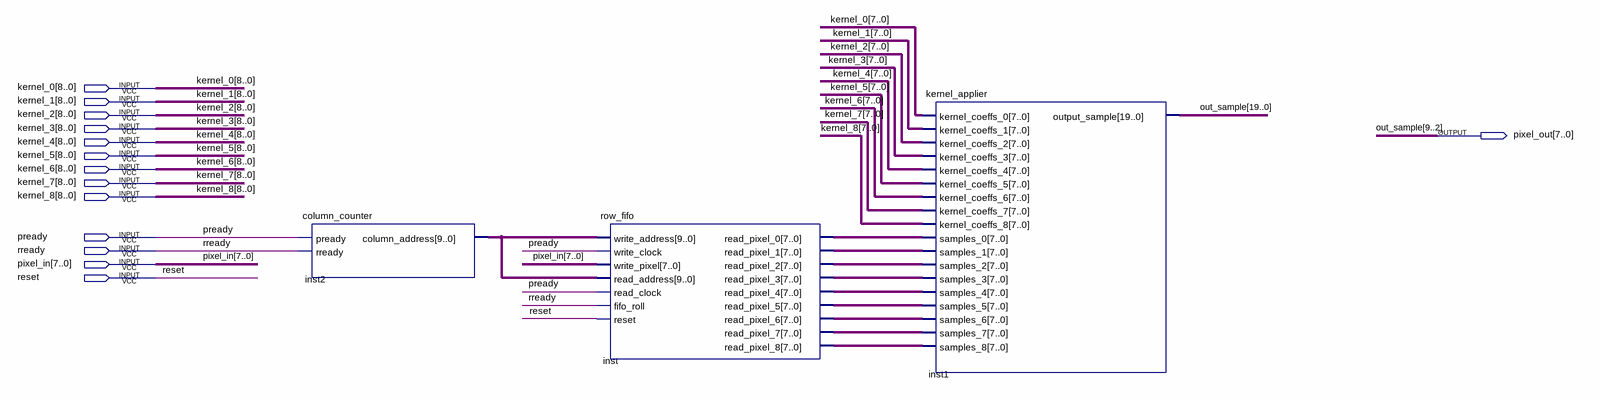
[diagram p0: schematic sheet]
// Quartus schematic processing.bdf as structural Verilog: 3 symbols, 14 pins
module processing (
  input  [8:0] kernel_0,
  input  [8:0] kernel_1,
  input  [8:0] kernel_2,
  input  [8:0] kernel_3,
  input  [8:0] kernel_4,
  input  [8:0] kernel_5,
  input  [8:0] kernel_6,
  input  [8:0] kernel_7,
  input  [8:0] kernel_8,
  input  pready,
  input  rready,
  input  [7:0] pixel_in,
  input  reset,
  output [7:0] pixel_out
);

  wire [7:0] inst_read_pixel_0, inst_read_pixel_1, inst_read_pixel_2, inst_read_pixel_3, inst_read_pixel_4,
       inst_read_pixel_5, inst_read_pixel_6, inst_read_pixel_7, inst_read_pixel_8;
  wire [9:0] inst2_column_address;
  wire [19:0] out_sample;

  column_counter inst2 (.pready(pready), .rready(rready), .column_address(inst2_column_address));
  row_fifo inst (
    .write_address(inst2_column_address), .write_clock(pready), .write_pixel(pixel_in),
    .read_address(inst2_column_address), .read_clock(pready), .fifo_roll(rready), .reset(reset),
    .read_pixel_0(inst_read_pixel_0), .read_pixel_1(inst_read_pixel_1), .read_pixel_2(inst_read_pixel_2),
    .read_pixel_3(inst_read_pixel_3), .read_pixel_4(inst_read_pixel_4), .read_pixel_5(inst_read_pixel_5),
    .read_pixel_6(inst_read_pixel_6), .read_pixel_7(inst_read_pixel_7), .read_pixel_8(inst_read_pixel_8));
  kernel_applier inst1 (
    .kernel_coeffs_0(kernel_0[7:0]), .kernel_coeffs_1(kernel_1[7:0]), .kernel_coeffs_2(kernel_2[7:0]),
    .kernel_coeffs_3(kernel_3[7:0]), .kernel_coeffs_4(kernel_4[7:0]), .kernel_coeffs_5(kernel_5[7:0]),
    .kernel_coeffs_6(kernel_6[7:0]), .kernel_coeffs_7(kernel_7[7:0]), .kernel_coeffs_8(kernel_8[7:0]),
    .samples_0(inst_read_pixel_0), .samples_1(inst_read_pixel_1), .samples_2(inst_read_pixel_2),
    .samples_3(inst_read_pixel_3), .samples_4(inst_read_pixel_4), .samples_5(inst_read_pixel_5),
    .samples_6(inst_read_pixel_6), .samples_7(inst_read_pixel_7), .samples_8(inst_read_pixel_8),
    .output_sample({out_sample[19:10], pixel_out, out_sample[1:0]}));

  // Other names for the same wires on the sheet: out_sample[9:2] = pixel_out
endmodule
